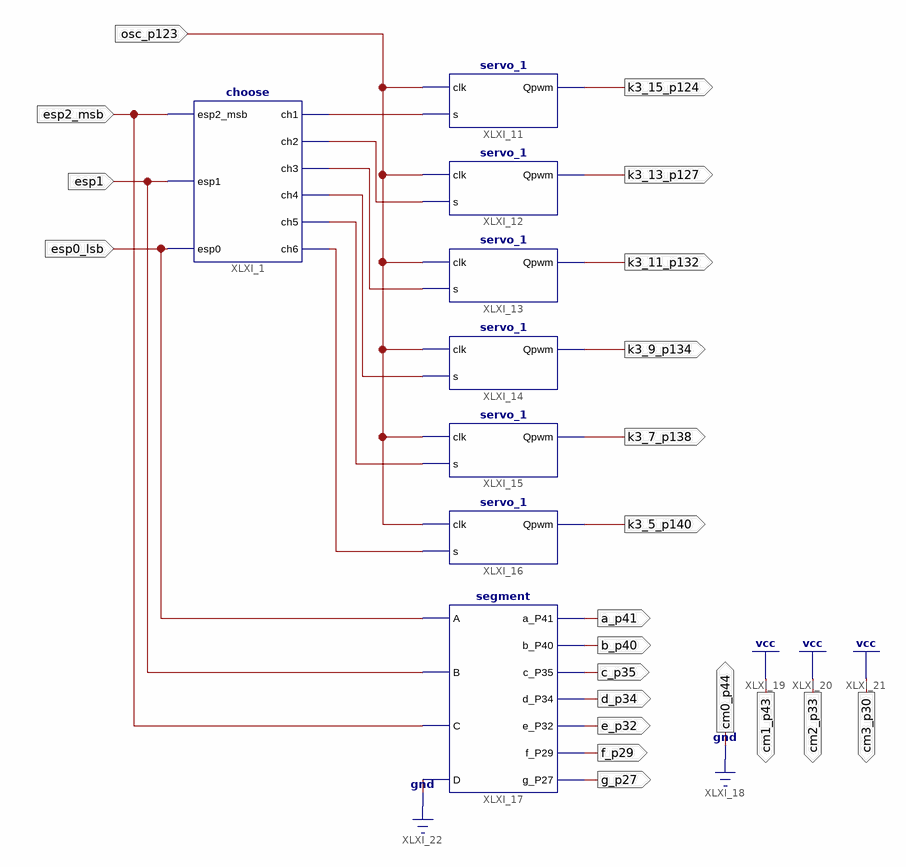
[diagram p0: schematic sheet 1]
// Xilinx ISE schematic locker.sch (spartan6) as structural Verilog: 8 symbols, 21 ports
module locker (
  input  osc_p123,
  input  esp2_msb,
  input  esp1,
  input  esp0_lsb,
  output k3_13_p127,
  output k3_11_p132,
  output k3_15_p124,
  output k3_9_p134,
  output k3_7_p138,
  output k3_5_p140,
  output a_p41,
  output b_p40,
  output c_p35,
  output d_p34,
  output e_p32,
  output f_p29,
  output g_p27,
  output cm0_p44,
  output cm1_p43,
  output cm2_p33,
  output cm3_p30
);

  wire XLXN_55, XLXN_56, XLXN_57, XLXN_58, XLXN_59, XLXN_60;

  choose XLXI_1 (
    .esp2_msb(esp2_msb), .esp1(esp1), .esp0(esp0_lsb), .ch1(XLXN_55), .ch2(XLXN_56), .ch3(XLXN_57),
    .ch4(XLXN_58), .ch5(XLXN_59), .ch6(XLXN_60));
  servo_1 XLXI_13 (.clk(osc_p123), .s(XLXN_57), .Qpwm(k3_11_p132));
  servo_1 XLXI_14 (.clk(osc_p123), .s(XLXN_58), .Qpwm(k3_9_p134));
  servo_1 XLXI_15 (.clk(osc_p123), .s(XLXN_59), .Qpwm(k3_7_p138));
  servo_1 XLXI_16 (.clk(osc_p123), .s(XLXN_60), .Qpwm(k3_5_p140));
  servo_1 XLXI_11 (.clk(osc_p123), .s(XLXN_55), .Qpwm(k3_15_p124));
  servo_1 XLXI_12 (.clk(osc_p123), .s(XLXN_56), .Qpwm(k3_13_p127));
  segment XLXI_17 (
    .A(esp0_lsb), .B(esp1), .C(esp2_msb), .D(1'b0), .a_P41(a_p41), .b_P40(b_p40), .c_P35(c_p35),
    .d_P34(d_p34), .e_P32(e_p32), .f_P29(f_p29), .g_P27(g_p27));

  assign cm0_p44 = 1'b0;
  assign cm1_p43 = 1'b1;
  assign cm2_p33 = 1'b1;
  assign cm3_p30 = 1'b1;
endmodule
